# Altium schematic sheet LED.SchDoc: Модуль индикации
size 594 x 420 mm; CheckedBy: Алексеев; Author: Нгуен; CompanyName: ПИСК, гр.912601; DrawnBy: Алексеев; Engineer: Алексеев; Address3: Т; Address4: синтезаторы частоты; DocumentNumber: ГУИР.467872.014-002 Э3; SheetNumber: 1; SheetTotal: 1; ImagePath: Евдокимова
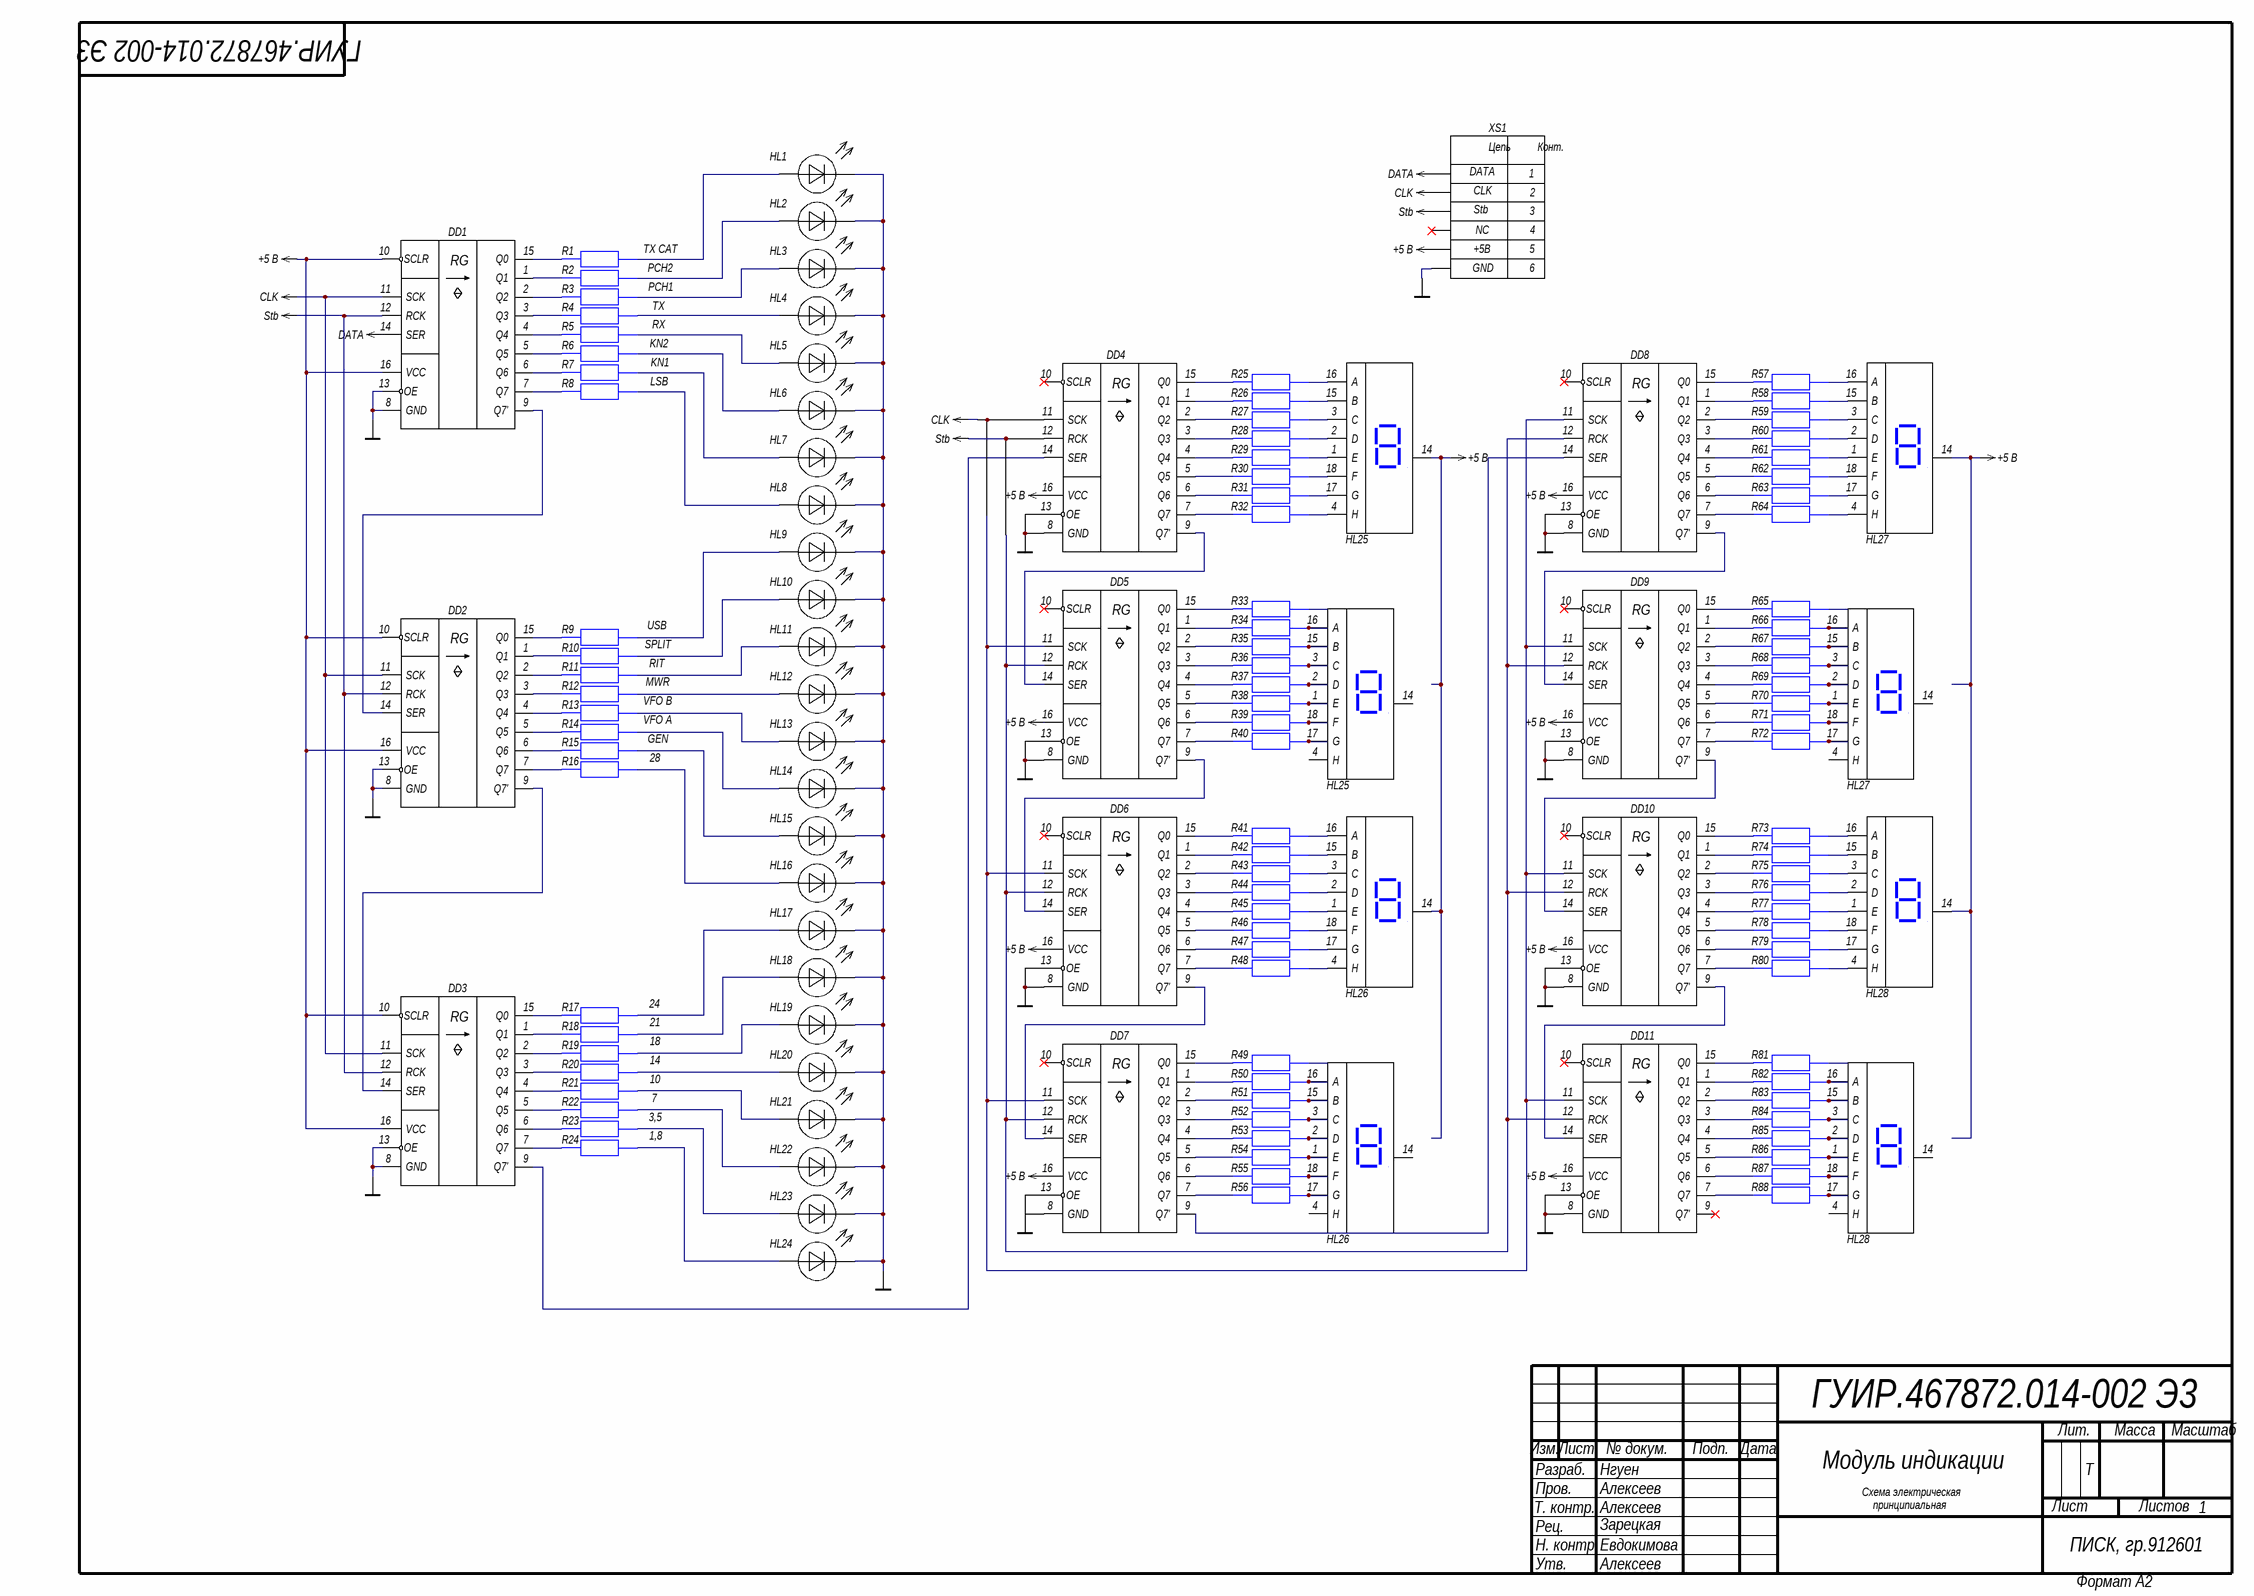
[diagram p0: LED.SchDoc]

## Parts
(Parts that share a designator on the sheet are numbered #1, #2 ... from top to bottom, then left to right.)
DD1  74HC595D  [74HC595]  (value not drawn)
DD2  74HC595D  [74HC595]  (value not drawn)
DD3  74HC595D  [74HC595]  (value not drawn)
DD4  74HC595D  [74HC595]  (value not drawn)
DD5  74HC595D  [74HC595]  (value not drawn)
DD6  74HC595D  [74HC595]  (value not drawn)
DD7  74HC595D  [74HC595]  (value not drawn)
DD8  74HC595D  [74HC595]  (value not drawn)
DD9  74HC595D  [74HC595]  (value not drawn)
DD10  74HC595D  [74HC595]  (value not drawn)
DD11  74HC595D  [74HC595]  (value not drawn)
HL1  LED  [LED 3mm]  (value not drawn)
HL2  LED  [LED 3mm]  (value not drawn)
HL3  LED  [LED 3mm]  (value not drawn)
HL4  LED  [LED 3mm]  (value not drawn)
HL5  LED  [LED 3mm]  (value not drawn)
HL6  LED  [LED 3mm]  (value not drawn)
HL7  LED  [LED 3mm]  (value not drawn)
HL8  LED  [LED 3mm]  (value not drawn)
HL9  LED  [LED 3mm]  (value not drawn)
HL10  LED  [LED 3mm]  (value not drawn)
HL11  LED  [LED 3mm]  (value not drawn)
HL12  LED  [LED 3mm]  (value not drawn)
HL13  LED  [LED 3mm]  (value not drawn)
HL14  LED  [LED 3mm]  (value not drawn)
HL15  LED  [LED 3mm]  (value not drawn)
HL16  LED  [LED 3mm]  (value not drawn)
HL17  LED  [LED 3mm]  (value not drawn)
HL18  LED  [LED 3mm]  (value not drawn)
HL19  LED  [LED 3mm]  (value not drawn)
HL20  LED  [LED 3mm]  (value not drawn)
HL21  LED  [LED 3mm]  (value not drawn)
HL22  LED  [LED 3mm]  (value not drawn)
HL23  LED  [LED 3mm]  (value not drawn)
HL24  LED  [LED 3mm]  (value not drawn)
HL25#1  LED8  [LED7x2]  (value not drawn)
HL25#2  LED8  [LED7x2]  (value not drawn)
HL26#1  LED8  [LED7x2]  (value not drawn)
HL26#2  LED8  [LED7x2]  (value not drawn)
HL27#1  LED8  [LED7x2]  (value not drawn)
HL27#2  LED8  [LED7x2]  (value not drawn)
HL28#1  LED8  [LED7x2]  (value not drawn)
HL28#2  LED8  [LED7x2]  (value not drawn)
R1  res-0.125w  [res-0805-0.125]  (value not drawn)
R2  res-0.125w  [res-0805-0.125]  (value not drawn)
R3  res-0.125w  [res-0805-0.125]  (value not drawn)
R4  res-0.125w  [res-0805-0.125]  (value not drawn)
R5  res-0.125w  [res-0805-0.125]  (value not drawn)
R6  res-0.125w  [res-0805-0.125]  (value not drawn)
R7  res-0.125w  [res-0805-0.125]  (value not drawn)
R8  res-0.125w  [res-0805-0.125]  (value not drawn)
R9  res-0.125w  [res-0805-0.125]  (value not drawn)
R10  res-0.125w  [res-0805-0.125]  (value not drawn)
R11  res-0.125w  [res-0805-0.125]  (value not drawn)
R12  res-0.125w  [res-0805-0.125]  (value not drawn)
R13  res-0.125w  [res-0805-0.125]  (value not drawn)
R14  res-0.125w  [res-0805-0.125]  (value not drawn)
R15  res-0.125w  [res-0805-0.125]  (value not drawn)
R16  res-0.125w  [res-0805-0.125]  (value not drawn)
R17  res-0.125w  [res-0805-0.125]  (value not drawn)
R18  res-0.125w  [res-0805-0.125]  (value not drawn)
R19  res-0.125w  [res-0805-0.125]  (value not drawn)
R20  res-0.125w  [res-0805-0.125]  (value not drawn)
R21  res-0.125w  [res-0805-0.125]  (value not drawn)
R22  res-0.125w  [res-0805-0.125]  (value not drawn)
R23  res-0.125w  [res-0805-0.125]  (value not drawn)
R24  res-0.125w  [res-0805-0.125]  (value not drawn)
R25  res-0.125w  [res-0805-0.125]  (value not drawn)
R26  res-0.125w  [res-0805-0.125]  (value not drawn)
R27  res-0.125w  [res-0805-0.125]  (value not drawn)
R28  res-0.125w  [res-0805-0.125]  (value not drawn)
R29  res-0.125w  [res-0805-0.125]  (value not drawn)
R30  res-0.125w  [res-0805-0.125]  (value not drawn)
R31  res-0.125w  [res-0805-0.125]  (value not drawn)
R32  res-0.125w  [res-0805-0.125]  (value not drawn)
R33  res-0.125w  [res-0805-0.125]  (value not drawn)
R34  res-0.125w  [res-0805-0.125]  (value not drawn)
R35  res-0.125w  [res-0805-0.125]  (value not drawn)
R36  res-0.125w  [res-0805-0.125]  (value not drawn)
R37  res-0.125w  [res-0805-0.125]  (value not drawn)
R38  res-0.125w  [res-0805-0.125]  (value not drawn)
R39  res-0.125w  [res-0805-0.125]  (value not drawn)
R40  res-0.125w  [res-0805-0.125]  (value not drawn)
R41  res-0.125w  [res-0805-0.125]  (value not drawn)
R42  res-0.125w  [res-0805-0.125]  (value not drawn)
R43  res-0.125w  [res-0805-0.125]  (value not drawn)
R44  res-0.125w  [res-0805-0.125]  (value not drawn)
R45  res-0.125w  [res-0805-0.125]  (value not drawn)
R46  res-0.125w  [res-0805-0.125]  (value not drawn)
R47  res-0.125w  [res-0805-0.125]  (value not drawn)
R48  res-0.125w  [res-0805-0.125]  (value not drawn)
R49  res-0.125w  [res-0805-0.125]  (value not drawn)
R50  res-0.125w  [res-0805-0.125]  (value not drawn)
R51  res-0.125w  [res-0805-0.125]  (value not drawn)
R52  res-0.125w  [res-0805-0.125]  (value not drawn)
R53  res-0.125w  [res-0805-0.125]  (value not drawn)
R54  res-0.125w  [res-0805-0.125]  (value not drawn)
R55  res-0.125w  [res-0805-0.125]  (value not drawn)
R56  res-0.125w  [res-0805-0.125]  (value not drawn)
R57  res-0.125w  [res-0805-0.125]  (value not drawn)
R58  res-0.125w  [res-0805-0.125]  (value not drawn)
R59  res-0.125w  [res-0805-0.125]  (value not drawn)
R60  res-0.125w  [res-0805-0.125]  (value not drawn)
R61  res-0.125w  [res-0805-0.125]  (value not drawn)
R62  res-0.125w  [res-0805-0.125]  (value not drawn)
R63  res-0.125w  [res-0805-0.125]  (value not drawn)
R64  res-0.125w  [res-0805-0.125]  (value not drawn)
R65  res-0.125w  [res-0805-0.125]  (value not drawn)
R66  res-0.125w  [res-0805-0.125]  (value not drawn)
R67  res-0.125w  [res-0805-0.125]  (value not drawn)
R68  res-0.125w  [res-0805-0.125]  (value not drawn)
R69  res-0.125w  [res-0805-0.125]  (value not drawn)
R70  res-0.125w  [res-0805-0.125]  (value not drawn)
R71  res-0.125w  [res-0805-0.125]  (value not drawn)
R72  res-0.125w  [res-0805-0.125]  (value not drawn)
R73  res-0.125w  [res-0805-0.125]  (value not drawn)
R74  res-0.125w  [res-0805-0.125]  (value not drawn)
R75  res-0.125w  [res-0805-0.125]  (value not drawn)
R76  res-0.125w  [res-0805-0.125]  (value not drawn)
R77  res-0.125w  [res-0805-0.125]  (value not drawn)
R78  res-0.125w  [res-0805-0.125]  (value not drawn)
R79  res-0.125w  [res-0805-0.125]  (value not drawn)
R80  res-0.125w  [res-0805-0.125]  (value not drawn)
R81  res-0.125w  [res-0805-0.125]  (value not drawn)
R82  res-0.125w  [res-0805-0.125]  (value not drawn)
R83  res-0.125w  [res-0805-0.125]  (value not drawn)
R84  res-0.125w  [res-0805-0.125]  (value not drawn)
R85  res-0.125w  [res-0805-0.125]  (value not drawn)
R86  res-0.125w  [res-0805-0.125]  (value not drawn)
R87  res-0.125w  [res-0805-0.125]  (value not drawn)
R88  res-0.125w  [res-0805-0.125]  (value not drawn)
XS1  Разьем 6 кон.  [B6B-PH-SM4-TB]  (value not drawn)

## Nets
+5 В: DD1.10(SCLR) DD1.16(VCC) DD2.10(SCLR) DD2.16(VCC) DD3.10(SCLR) DD3.16(VCC) DD4.16(VCC) DD5.16(VCC) DD6.16(VCC) DD7.16(VCC) DD8.16(VCC) DD9.16(VCC) DD10.16(VCC) DD11.16(VCC) HL25#1.14(a) HL26#1.14(a) HL27#1.14(a) HL28#1.14(a) XS1.5
CLK: DD1.11(SCK) DD2.11(SCK) DD3.11(SCK) DD4.11(SCK) DD5.11(SCK) DD6.11(SCK) DD7.11(SCK) DD8.11(SCK) DD9.11(SCK) DD10.11(SCK) DD11.11(SCK) XS1.2
DATA: DD1.14(SER) XS1.1
GND: DD1.8(GND) DD1.13(OE) DD2.8(GND) DD2.13(OE) DD3.8(GND) DD3.13(OE) DD4.8(GND) DD4.13(OE) DD5.8(GND) DD5.13(OE) DD6.8(GND) DD6.13(OE) DD7.8(GND) DD7.13(OE) DD8.8(GND) DD8.13(OE) DD9.8(GND) DD9.13(OE) DD10.8(GND) DD10.13(OE) DD11.8(GND) DD11.13(OE) HL1.2(K) HL2.2(K) HL3.2(K) HL4.2(K) HL5.2(K) HL6.2(K) HL7.2(K) HL8.2(K) HL9.2(K) HL10.2(K) HL11.2(K) HL12.2(K) HL13.2(K) HL14.2(K) HL15.2(K) HL16.2(K) HL17.2(K) HL18.2(K) HL19.2(K) HL20.2(K) HL21.2(K) HL22.2(K) HL23.2(K) HL24.2(K) XS1.6
Stb: DD1.12(RCK) DD2.12(RCK) DD3.12(RCK) DD4.12(RCK) DD5.12(RCK) DD6.12(RCK) DD7.12(RCK) DD8.12(RCK) DD9.12(RCK) DD10.12(RCK) DD11.12(RCK) XS1.3
NetDD1_1: DD1.1(Q1) R2.2
NetDD1_2: DD1.2(Q2) R3.2
NetDD1_3: DD1.3(Q3) R4.2
NetDD1_4: DD1.4(Q4) R5.2
NetDD1_5: DD1.5(Q5) R6.2
NetDD1_6: DD1.6(Q6) R7.2
NetDD1_7: DD1.7(Q7) R8.2
NetDD1_9: DD1.9(Q7') DD2.14(SER)
NetDD1_15: DD1.15(Q0) R1.2
NetDD2_1: DD2.1(Q1) R10.2
NetDD2_2: DD2.2(Q2) R11.2
NetDD2_3: DD2.3(Q3) R12.2
NetDD2_4: DD2.4(Q4) R13.2
NetDD2_5: DD2.5(Q5) R14.2
NetDD2_6: DD2.6(Q6) R15.2
NetDD2_7: DD2.7(Q7) R16.2
NetDD2_9: DD2.9(Q7') DD3.14(SER)
NetDD2_15: DD2.15(Q0) R9.2
NetDD3_1: DD3.1(Q1) R18.2
NetDD3_2: DD3.2(Q2) R19.2
NetDD3_3: DD3.3(Q3) R20.2
NetDD3_4: DD3.4(Q4) R21.2
NetDD3_5: DD3.5(Q5) R22.2
NetDD3_6: DD3.6(Q6) R23.2
NetDD3_7: DD3.7(Q7) R24.2
NetDD3_9: DD3.9(Q7') DD4.14(SER)
NetDD3_15: DD3.15(Q0) R17.2
NetDD4_1: DD4.1(Q1) R26.1
NetDD4_2: DD4.2(Q2) R27.1
NetDD4_3: DD4.3(Q3) R28.1
NetDD4_4: DD4.4(Q4) R29.1
NetDD4_5: DD4.5(Q5) R30.1
NetDD4_6: DD4.6(Q6) R31.1
NetDD4_7: DD4.7(Q7) R32.1
NetDD4_9: DD4.9(Q7') DD5.14(SER)
NetDD4_15: DD4.15(Q0) R25.1
NetDD5_1: DD5.1(Q1) R34.1
NetDD5_2: DD5.2(Q2) R35.1
NetDD5_3: DD5.3(Q3) R36.1
NetDD5_4: DD5.4(Q4) R37.1
NetDD5_5: DD5.5(Q5) R38.1
NetDD5_6: DD5.6(Q6) R39.1
NetDD5_7: DD5.7(Q7) R40.1
NetDD5_9: DD5.9(Q7') DD6.14(SER)
NetDD5_15: DD5.15(Q0) R33.1
NetDD6_1: DD6.1(Q1) R42.1
NetDD6_2: DD6.2(Q2) R43.1
NetDD6_3: DD6.3(Q3) R44.1
NetDD6_4: DD6.4(Q4) R45.1
NetDD6_5: DD6.5(Q5) R46.1
NetDD6_6: DD6.6(Q6) R47.1
NetDD6_7: DD6.7(Q7) R48.1
NetDD6_9: DD6.9(Q7') DD7.14(SER)
NetDD6_15: DD6.15(Q0) R41.1
NetDD7_1: DD7.1(Q1) R50.1
NetDD7_2: DD7.2(Q2) R51.1
NetDD7_3: DD7.3(Q3) R52.1
NetDD7_4: DD7.4(Q4) R53.1
NetDD7_5: DD7.5(Q5) R54.1
NetDD7_6: DD7.6(Q6) R55.1
NetDD7_7: DD7.7(Q7) R56.1
NetDD7_9: DD7.9(Q7') DD8.14(SER)
NetDD7_15: DD7.15(Q0) R49.1
NetDD8_1: DD8.1(Q1) R58.1
NetDD8_2: DD8.2(Q2) R59.1
NetDD8_3: DD8.3(Q3) R60.1
NetDD8_4: DD8.4(Q4) R61.1
NetDD8_5: DD8.5(Q5) R62.1
NetDD8_6: DD8.6(Q6) R63.1
NetDD8_7: DD8.7(Q7) R64.1
NetDD8_9: DD8.9(Q7') DD9.14(SER)
NetDD8_15: DD8.15(Q0) R57.1
NetDD9_1: DD9.1(Q1) R66.1
NetDD9_2: DD9.2(Q2) R67.1
NetDD9_3: DD9.3(Q3) R68.1
NetDD9_4: DD9.4(Q4) R69.1
NetDD9_5: DD9.5(Q5) R70.1
NetDD9_6: DD9.6(Q6) R71.1
NetDD9_7: DD9.7(Q7) R72.1
NetDD9_9: DD9.9(Q7') DD10.14(SER)
NetDD9_15: DD9.15(Q0) R65.1
NetDD10_1: DD10.1(Q1) R74.1
NetDD10_2: DD10.2(Q2) R75.1
NetDD10_3: DD10.3(Q3) R76.1
NetDD10_4: DD10.4(Q4) R77.1
NetDD10_5: DD10.5(Q5) R78.1
NetDD10_6: DD10.6(Q6) R79.1
NetDD10_7: DD10.7(Q7) R80.1
NetDD10_9: DD10.9(Q7') DD11.14(SER)
NetDD10_15: DD10.15(Q0) R73.1
NetDD11_1: DD11.1(Q1) R82.1
NetDD11_2: DD11.2(Q2) R83.1
NetDD11_3: DD11.3(Q3) R84.1
NetDD11_4: DD11.4(Q4) R85.1
NetDD11_5: DD11.5(Q5) R86.1
NetDD11_6: DD11.6(Q6) R87.1
NetDD11_7: DD11.7(Q7) R88.1
NetDD11_15: DD11.15(Q0) R81.1
NetHL1_1: HL1.1(А) R1.1
NetHL2_1: HL2.1(А) R2.1
NetHL3_1: HL3.1(А) R3.1
NetHL4_1: HL4.1(А) R4.1
NetHL5_1: HL5.1(А) R5.1
NetHL6_1: HL6.1(А) R6.1
NetHL7_1: HL7.1(А) R7.1
NetHL8_1: HL8.1(А) R8.1
NetHL9_1: HL9.1(А) R9.1
NetHL10_1: HL10.1(А) R10.1
NetHL11_1: HL11.1(А) R11.1
NetHL12_1: HL12.1(А) R12.1
NetHL13_1: HL13.1(А) R13.1
NetHL14_1: HL14.1(А) R14.1
NetHL15_1: HL15.1(А) R15.1
NetHL16_1: HL16.1(А) R16.1
NetHL17_1: HL17.1(А) R17.1
NetHL18_1: HL18.1(А) R18.1
NetHL19_1: HL19.1(А) R19.1
NetHL20_1: HL20.1(А) R20.1
NetHL21_1: HL21.1(А) R21.1
NetHL22_1: HL22.1(А) R22.1
NetHL23_1: HL23.1(А) R23.1
NetHL24_1: HL24.1(А) R24.1
NetHL25#1_1: HL25#1.1(E) R29.2
NetHL25#1_2: HL25#1.2(D) R28.2
NetHL25#1_3: HL25#1.3(C) R27.2
NetHL25#1_4: HL25#1.4(H) R32.2
NetHL25#1_15: HL25#1.15(B) R26.2
NetHL25#1_16: HL25#1.16(A) R25.2
NetHL25#1_17: HL25#1.17(G) R31.2
NetHL25#1_18: HL25#1.18(F) R30.2
NetHL25#2_1: HL25#2.1(E) R38.2
NetHL25#2_2: HL25#2.2(D) R37.2
NetHL25#2_3: HL25#2.3(C) R36.2
NetHL25#2_15: HL25#2.15(B) R35.2
NetHL25#2_16: HL25#2.16(A) R34.2
NetHL25#2_17: HL25#2.17(G) R40.2
NetHL25#2_18: HL25#2.18(F) R39.2
NetHL26#1_1: HL26#1.1(E) R45.2
NetHL26#1_2: HL26#1.2(D) R44.2
NetHL26#1_3: HL26#1.3(C) R43.2
NetHL26#1_4: HL26#1.4(H) R48.2
NetHL26#1_15: HL26#1.15(B) R42.2
NetHL26#1_16: HL26#1.16(A) R41.2
NetHL26#1_17: HL26#1.17(G) R47.2
NetHL26#1_18: HL26#1.18(F) R46.2
NetHL26#2_1: HL26#2.1(E) R54.2
NetHL26#2_2: HL26#2.2(D) R53.2
NetHL26#2_3: HL26#2.3(C) R52.2
NetHL26#2_15: HL26#2.15(B) R51.2
NetHL26#2_16: HL26#2.16(A) R50.2
NetHL26#2_17: HL26#2.17(G) R56.2
NetHL26#2_18: HL26#2.18(F) R55.2
NetHL27#1_1: HL27#1.1(E) R61.2
NetHL27#1_2: HL27#1.2(D) R60.2
NetHL27#1_3: HL27#1.3(C) R59.2
NetHL27#1_4: HL27#1.4(H) R64.2
NetHL27#1_15: HL27#1.15(B) R58.2
NetHL27#1_16: HL27#1.16(A) R57.2
NetHL27#1_17: HL27#1.17(G) R63.2
NetHL27#1_18: HL27#1.18(F) R62.2
NetHL27#2_1: HL27#2.1(E) R70.2
NetHL27#2_2: HL27#2.2(D) R69.2
NetHL27#2_3: HL27#2.3(C) R68.2
NetHL27#2_15: HL27#2.15(B) R67.2
NetHL27#2_16: HL27#2.16(A) R66.2
NetHL27#2_17: HL27#2.17(G) R72.2
NetHL27#2_18: HL27#2.18(F) R71.2
NetHL28#1_1: HL28#1.1(E) R77.2
NetHL28#1_2: HL28#1.2(D) R76.2
NetHL28#1_3: HL28#1.3(C) R75.2
NetHL28#1_4: HL28#1.4(H) R80.2
NetHL28#1_15: HL28#1.15(B) R74.2
NetHL28#1_16: HL28#1.16(A) R73.2
NetHL28#1_17: HL28#1.17(G) R79.2
NetHL28#1_18: HL28#1.18(F) R78.2
NetHL28#2_1: HL28#2.1(E) R86.2
NetHL28#2_2: HL28#2.2(D) R85.2
NetHL28#2_3: HL28#2.3(C) R84.2
NetHL28#2_15: HL28#2.15(B) R83.2
NetHL28#2_16: HL28#2.16(A) R82.2
NetHL28#2_17: HL28#2.17(G) R88.2
NetHL28#2_18: HL28#2.18(F) R87.2

Not connected (* = marked no-connect by the designer): DD4 10(SCLR)*; DD5 10(SCLR)*; DD6 10(SCLR)*; DD7 10(SCLR)*; DD8 10(SCLR)*; DD9 10(SCLR)*; DD10 10(SCLR)*; DD11 9(Q7')* 10(SCLR)*; HL25#2 4(H) 14(a); HL26#2 4(H) 14(a); HL27#2 4(H) 14(a); HL28#2 4(H) 14(a); R33 2; R49 2; R65 2; R81 2; XS1 4*

## Notes on the sheet
- (near XS1) DATA
- (near XS1) CLK
- (near XS1) Stb
- TX CAT
- (near XS1) +5B
- (near XS1) NC
- PCH2
- PCH1
- TX
- (near XS1) GND
- KN2
- RX
- LSB
- KN1
- SPLIT
- USB
- MWR
- RIT
- VFO A
- VFO B
- GEN
- 28
- 24
- 21
- 14
- 10
- 18
- 3,5
- 7
- 1,8
- Зарецкая
- Разраб.
- Изм.
- Лист
- № докум.
- Подп.
- Дата
- Лит.
- Масса
- Масштаб
- Т. контр.
- Пров.
- принципиальная
- Схема электрическая
- Листов
- Н. контр.
- Утв.
- Рец.
- Формат А2
- (in symbol 74HC595D) RG
- (in symbol Разьем 6 кон.) Цепь; Конт.

## Library data of the parts
HL1 = LED: TX CAT
HL2 = LED: PCH2
HL3 = LED: PCH1
HL4 = LED: TX
HL5 = LED: RX
HL6 = LED: KN2
HL7 = LED: KN1
HL8 = LED: LSB
HL9 = LED: USB
HL10 = LED: SPLIT
HL11 = LED: RIT
HL12 = LED: MWR
HL13 = LED: VF0 B
HL14 = LED: VF0 A
HL15 = LED: GEN
HL16 = LED: 28
HL17 = LED: 24
HL18 = LED: 21
HL19 = LED: 18
HL20 = LED: 14
HL21 = LED: 10
HL22 = LED: 7
HL23 = LED: 3.5
HL24 = LED: 1.8
XS1 = Разьем 6 кон.: System: Connector